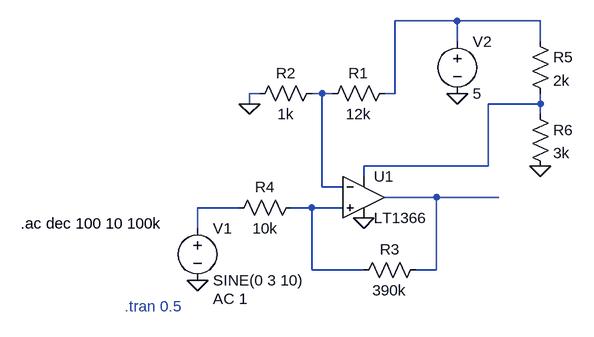
[diagram p0: schematic Comparator.asc]
Comparator.asc, the LTspice schematic file:
Version 4.1
SHEET 1 880 680
WIRE 0 80 -96 80
WIRE 128 80 0 80
WIRE 0 112 0 80
WIRE 128 112 128 80
WIRE -304 192 -320 192
WIRE -208 192 -224 192
WIRE -192 192 -208 192
WIRE -96 192 -96 80
WIRE -96 192 -112 192
WIRE -320 208 -320 192
WIRE 128 208 128 192
WIRE 128 208 48 208
WIRE 128 224 128 208
WIRE 48 304 48 208
WIRE 48 304 -144 304
WIRE -144 320 -144 304
WIRE -208 336 -208 192
WIRE -176 336 -208 336
WIRE -32 352 -112 352
WIRE 64 352 -32 352
WIRE -336 368 -400 368
WIRE -224 368 -256 368
WIRE -176 368 -224 368
WIRE -400 400 -400 368
WIRE -224 464 -224 368
WIRE -144 464 -224 464
WIRE -32 464 -32 352
WIRE -32 464 -64 464
FLAG -400 480 0
FLAG 0 192 0
FLAG -320 208 0
FLAG -144 384 0
FLAG 128 304 0
SYMBOL voltage -400 384 R0
WINDOW 123 24 124 Left 2
WINDOW 39 0 0 Left 0
SYMATTR Value2 AC 1
SYMATTR InstName V1
SYMATTR Value SINE(0 3 10)
SYMBOL voltage 0 96 R0
SYMATTR InstName V2
SYMATTR Value 5
SYMBOL res -96 176 R90
WINDOW 0 0 56 VBottom 2
WINDOW 3 32 56 VTop 2
SYMATTR InstName R1
SYMATTR Value 12k
SYMBOL res -208 176 R90
WINDOW 0 0 56 VBottom 2
WINDOW 3 32 56 VTop 2
SYMATTR InstName R2
SYMATTR Value 1k
SYMBOL res -48 448 R90
WINDOW 0 0 56 VBottom 2
WINDOW 3 32 56 VTop 2
SYMATTR InstName R3
SYMATTR Value 390k
SYMBOL res -240 352 R90
WINDOW 0 0 56 VBottom 2
WINDOW 3 32 56 VTop 2
SYMATTR InstName R4
SYMATTR Value 10k
SYMBOL res 112 96 R0
SYMATTR InstName R5
SYMATTR Value 2k
SYMBOL res 112 208 R0
SYMATTR InstName R6
SYMATTR Value 3k
SYMBOL OpAmps\\LT1366 -144 288 R0
SYMATTR InstName U1
TEXT -512 520 Left 2 ;.tran 0.5
TEXT -672 392 Left 2 !.ac dec 100 10 100k

The netlist it stands for:
* Comparator.asc
V1 N005 0 SINE(0 3 10) AC 1
V2 N001 0 5
R1 N001 N002 12k
R2 N002 0 1k
R3 N004 N006 390k
R4 N006 N005 10k
R5 N001 N003 2k
R6 N003 0 3k
X§U1 N006 N002 N003 0 N004 LT1366  ; pins In+ In- V+ V- OUT
* .tran 0.5
.ac dec 100 10 100k
.lib LTC.lib
.backanno
.end